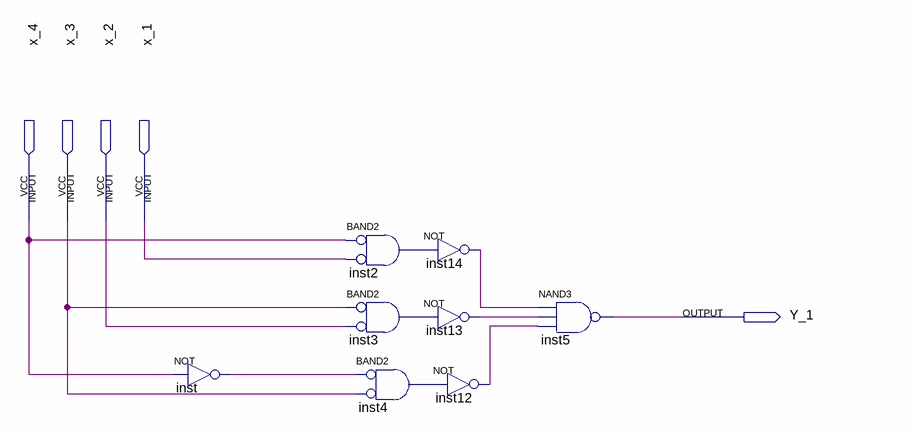
[diagram p0: schematic sheet]
// Quartus schematic Lab1_Block.bdf as structural Verilog: 8 symbols, 5 pins
module Lab1_Block (
  input  x_4,
  input  x_3,
  input  x_2,
  input  x_1,
  output Y_1
);

  wire inst2_out, inst3_out, inst4_out, inst12_out, inst13_out, inst14_out, inst_out;

  not inst (inst_out, x_4);
  and inst2 (inst2_out, ~x_4, ~x_1);  // BAND2
  and inst3 (inst3_out, ~x_3, ~x_2);  // BAND2
  and inst4 (inst4_out, ~inst_out, ~x_3);  // BAND2
  not inst14 (inst14_out, inst2_out);
  not inst13 (inst13_out, inst3_out);
  not inst12 (inst12_out, inst4_out);
  nand inst5 (Y_1, inst14_out, inst13_out, inst12_out);
endmodule
